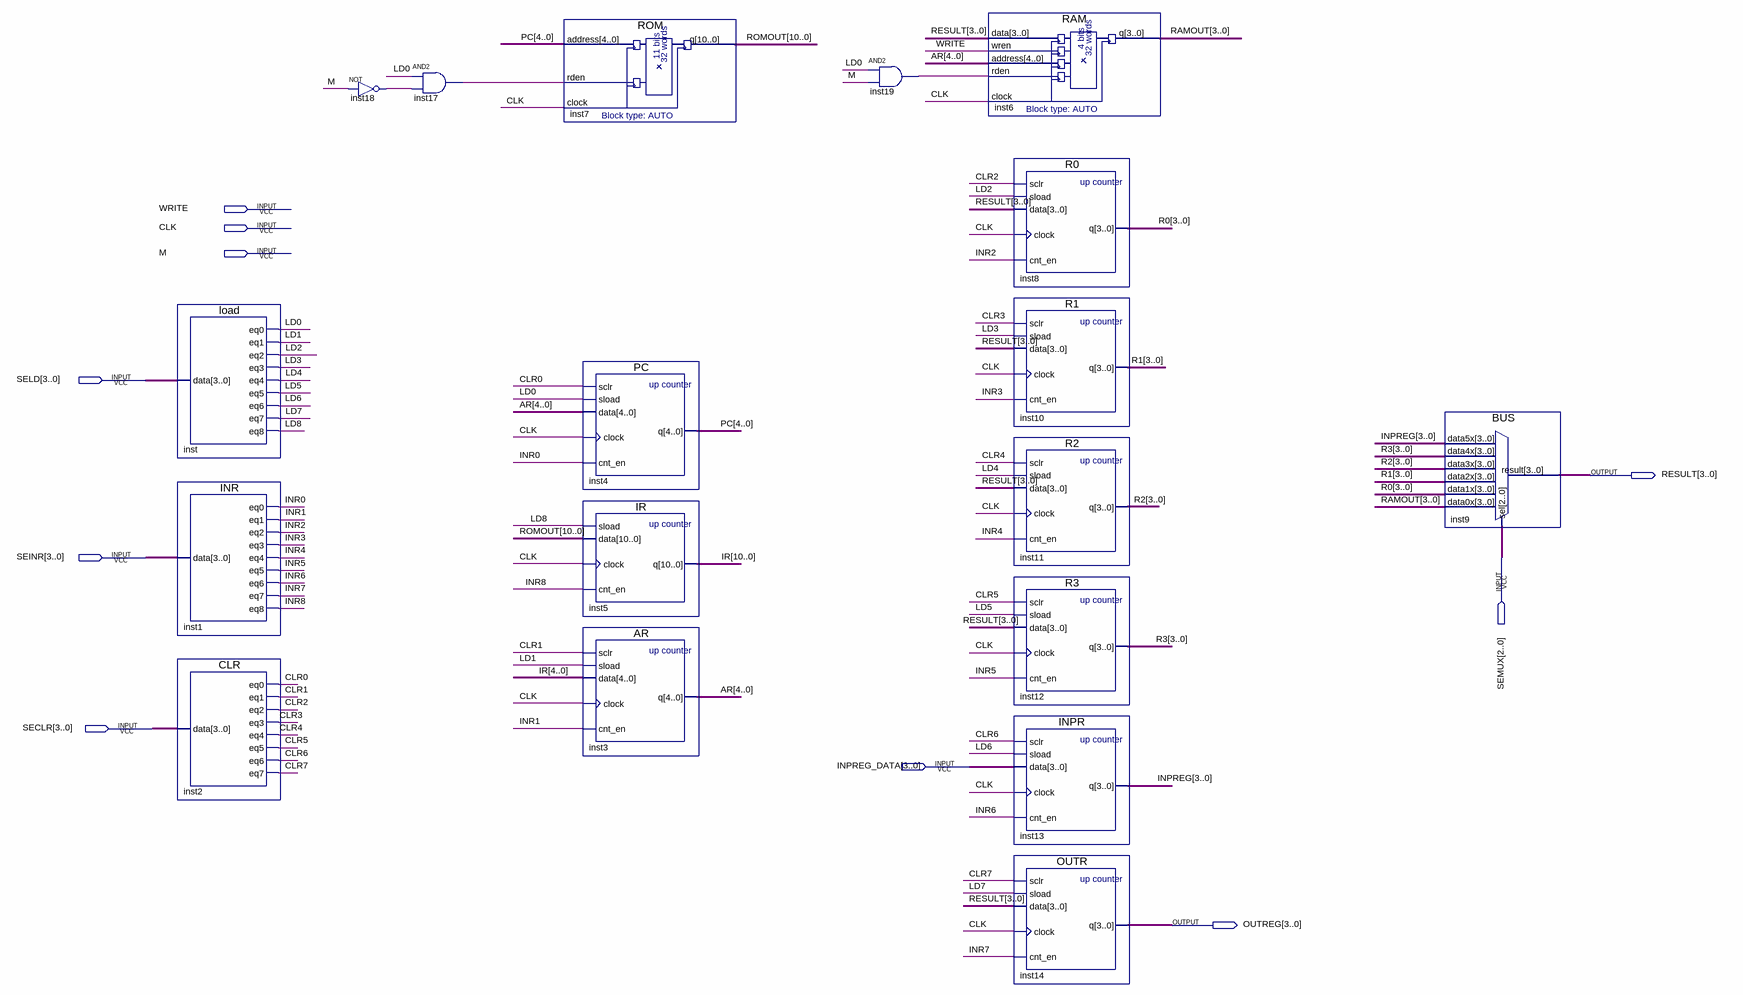
[diagram p0: schematic sheet]
// Quartus schematic DEUARC_BUSYSTEM.bdf as structural Verilog: 18 symbols, 10 pins
module DEUARC_BUSYSTEM (
  input  WRITE,
  input  CLK,
  input  M,
  input  [3:0] SELD,
  input  [3:0] SEINR,
  input  [2:0] SEMUX,
  input  [3:0] SECLR,
  input  [3:0] INPREG_DATA,
  output [3:0] RESULT,
  output [3:0] OUTREG
);

  wire CLR0, CLR1, CLR2, CLR3, CLR4, CLR5, CLR6, CLR7, INR0, INR1, INR2, INR3, INR4, INR5, INR6, INR7, INR8,
       inst17_out, inst18_out, inst19_out, LD0, LD1, LD2, LD3, LD4, LD5, LD6, LD7, LD8;
  wire [3:0] INPREG, R0, R1, R2, R3, RAMOUT;
  wire [4:0] AR, PC;
  wire [10:0] IR, ROMOUT;

  load inst (
    .data(SELD), .eq0(LD0), .eq1(LD1), .eq2(LD2), .eq3(LD3), .eq4(LD4), .eq5(LD5), .eq6(LD6), .eq7(LD7),
    .eq8(LD8));
  INR inst1 (
    .data(SEINR), .eq0(INR0), .eq1(INR1), .eq2(INR2), .eq3(INR3), .eq4(INR4), .eq5(INR5), .eq6(INR6),
    .eq7(INR7), .eq8(INR8));
  CLR inst2 (
    .data(SECLR), .eq0(CLR0), .eq1(CLR1), .eq2(CLR2), .eq3(CLR3), .eq4(CLR4), .eq5(CLR5), .eq6(CLR6),
    .eq7(CLR7));
  not inst18 (inst18_out, M);
  and inst17 (inst17_out, LD0, inst18_out);
  ROM inst7 (.address(PC), .rden(inst17_out), .clock(CLK), .q(ROMOUT));
  PC inst4 (.sclr(CLR0), .sload(LD0), .data(AR), .clock(CLK), .cnt_en(INR0), .q(PC));
  IR inst5 (.sload(LD8), .data(ROMOUT), .clock(CLK), .cnt_en(INR8), .q(IR));
  AR inst3 (.sclr(CLR1), .sload(LD1), .data(IR[4:0]), .clock(CLK), .cnt_en(INR1), .q(AR));
  and inst19 (inst19_out, LD0, M);
  RAM inst6 (.data(RESULT), .wren(WRITE), .address(AR), .rden(inst19_out), .clock(CLK), .q(RAMOUT));
  R0 inst8 (.sclr(CLR2), .sload(LD2), .data(RESULT), .clock(CLK), .cnt_en(INR2), .q(R0));
  R1 inst10 (.sclr(CLR3), .sload(LD3), .data(RESULT), .clock(CLK), .cnt_en(INR3), .q(R1));
  R2 inst11 (.sclr(CLR4), .sload(LD4), .data(RESULT), .clock(CLK), .cnt_en(INR4), .q(R2));
  R3 inst12 (.sclr(CLR5), .sload(LD5), .data(RESULT), .clock(CLK), .cnt_en(INR5), .q(R3));
  INPR inst13 (.sclr(CLR6), .sload(LD6), .data(INPREG_DATA), .clock(CLK), .cnt_en(INR6), .q(INPREG));
  OUTR inst14 (.sclr(CLR7), .sload(LD7), .data(RESULT), .clock(CLK), .cnt_en(INR7), .q(OUTREG));
  BUS inst9 (
    .data5x(INPREG), .data4x(R3), .data3x(R2), .data2x(R1), .data1x(R0), .data0x(RAMOUT), .sel(SEMUX),
    .result(RESULT));
endmodule
